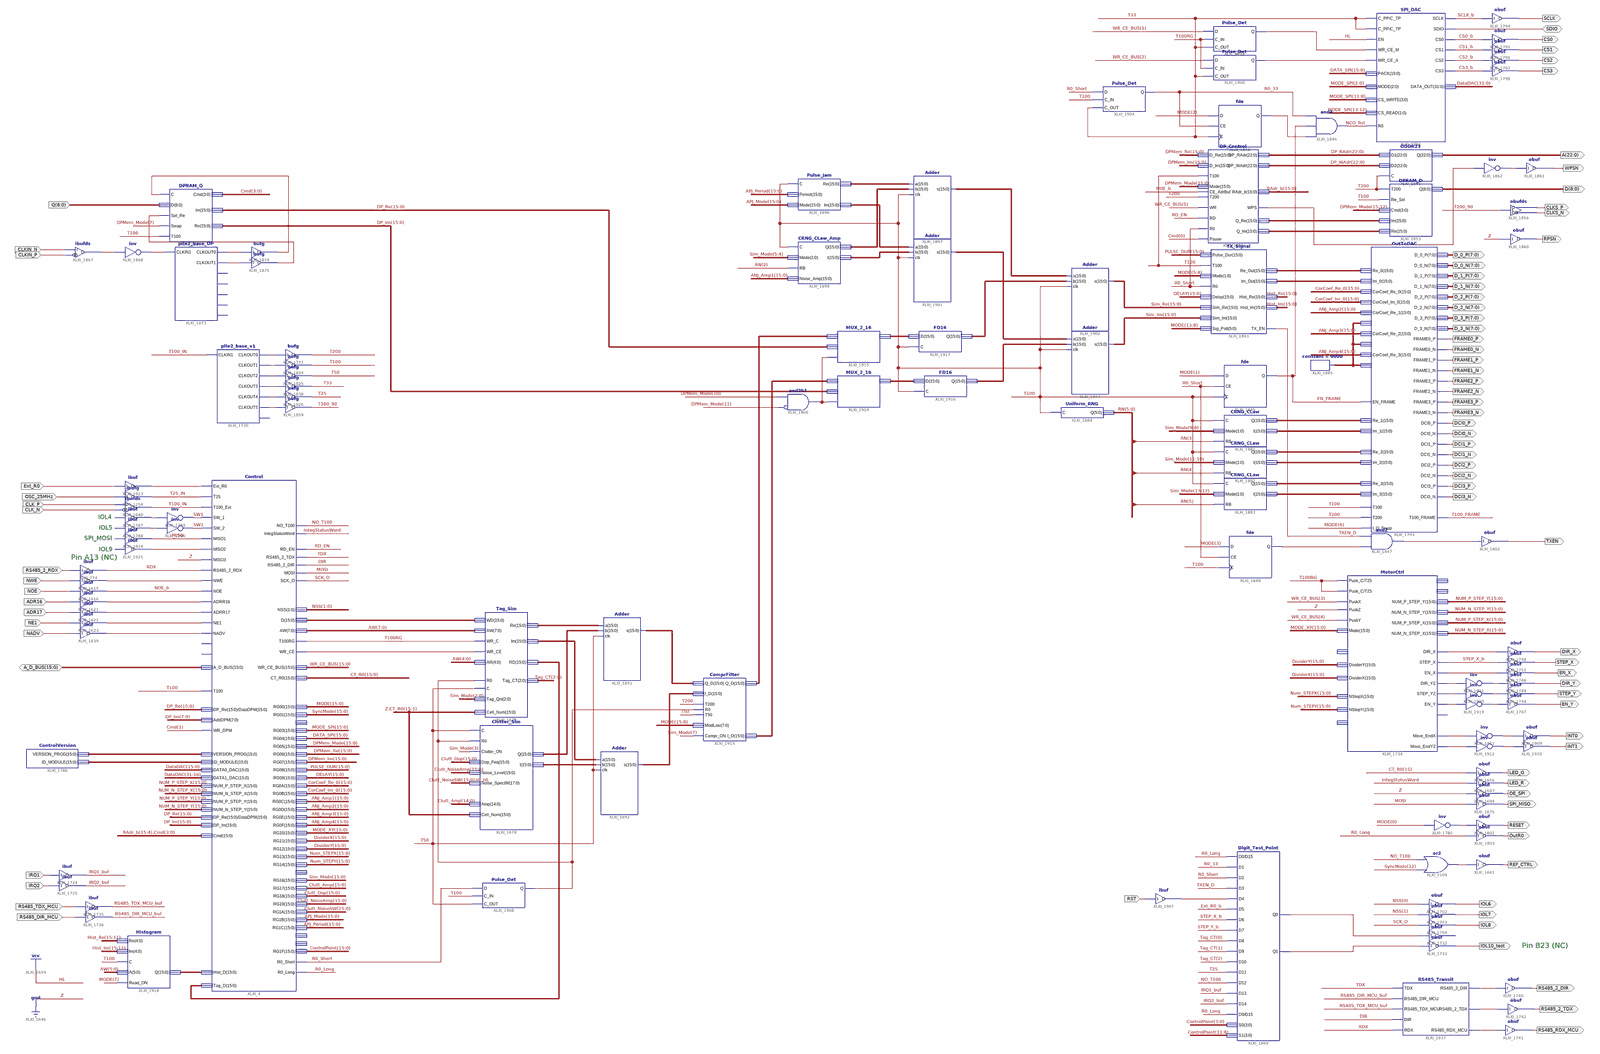
[diagram p0: schematic sheet 1, whole]
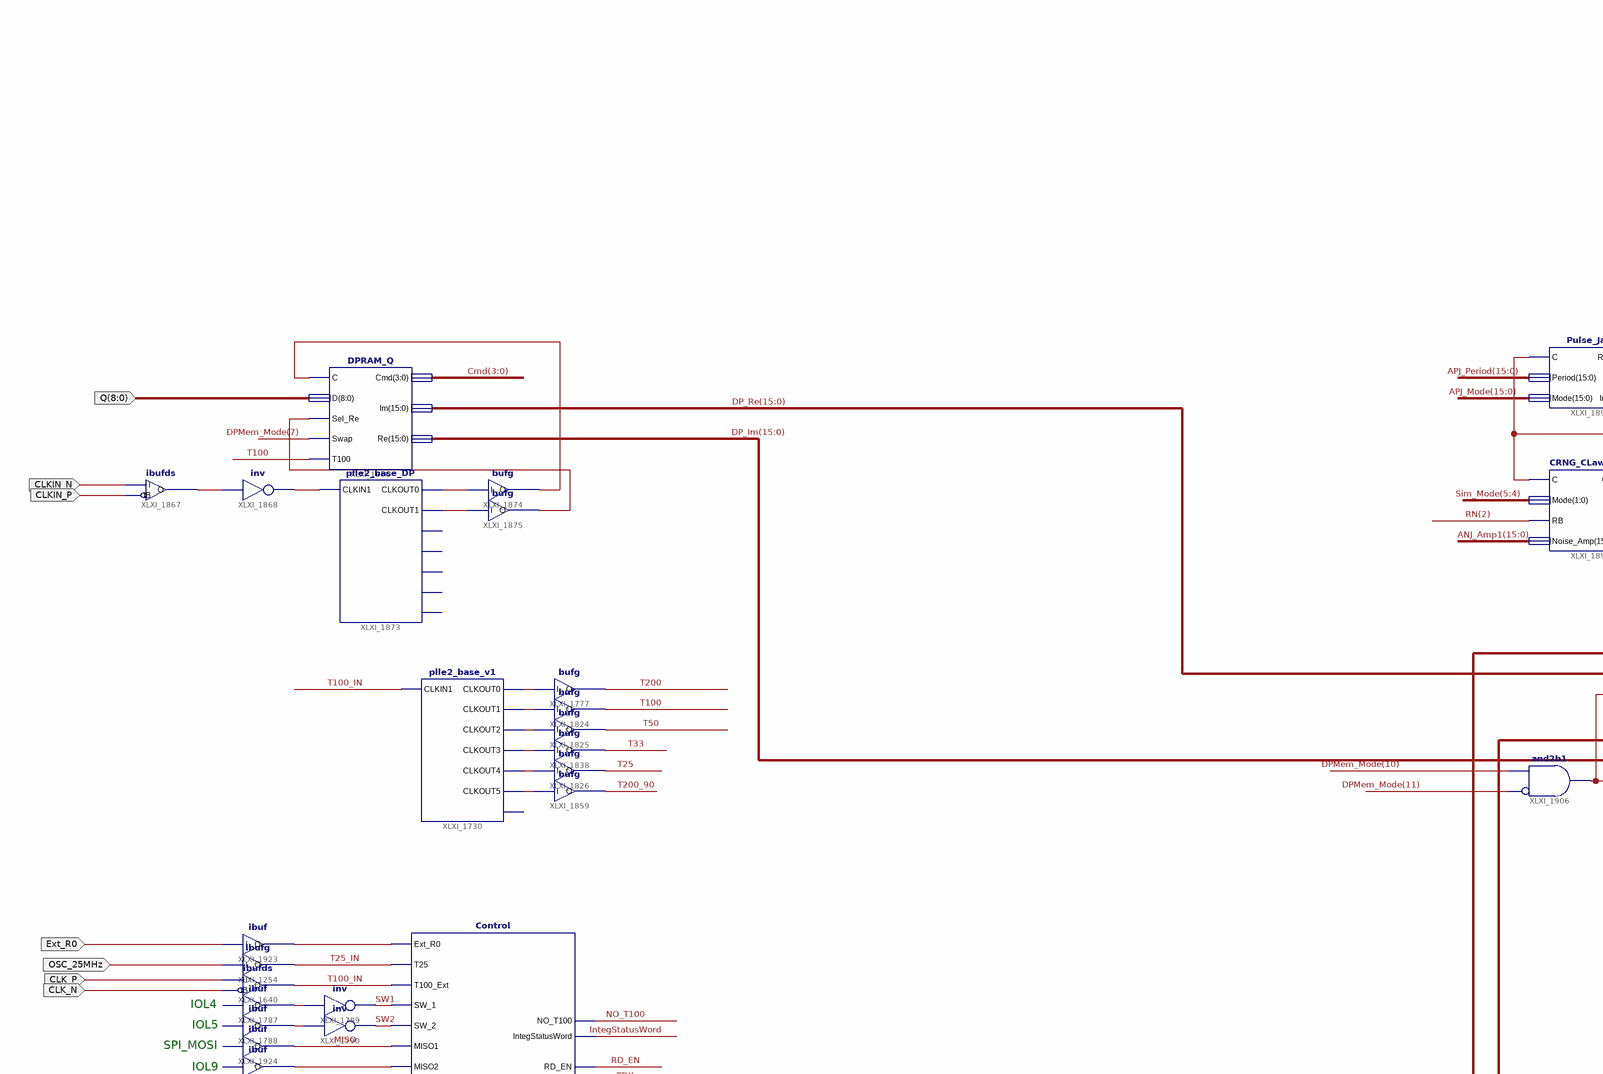
[diagram p1: schematic sheet 1, upper left part]
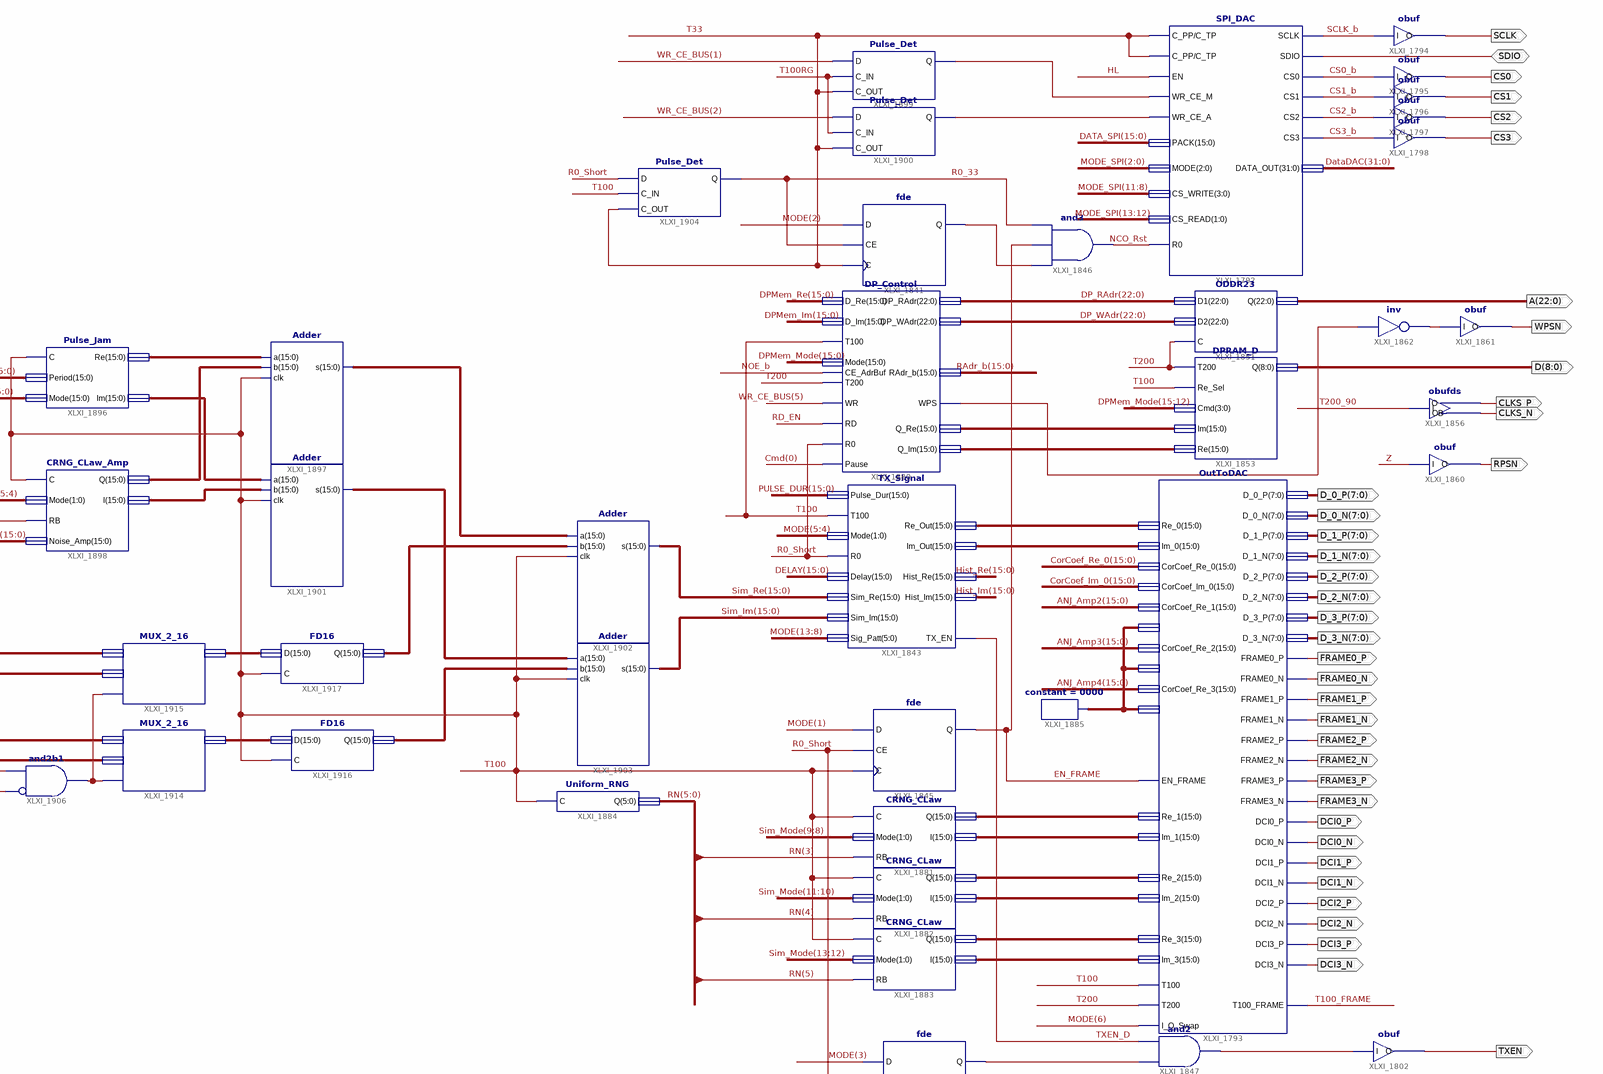
[diagram p2: schematic sheet 1, upper right part]
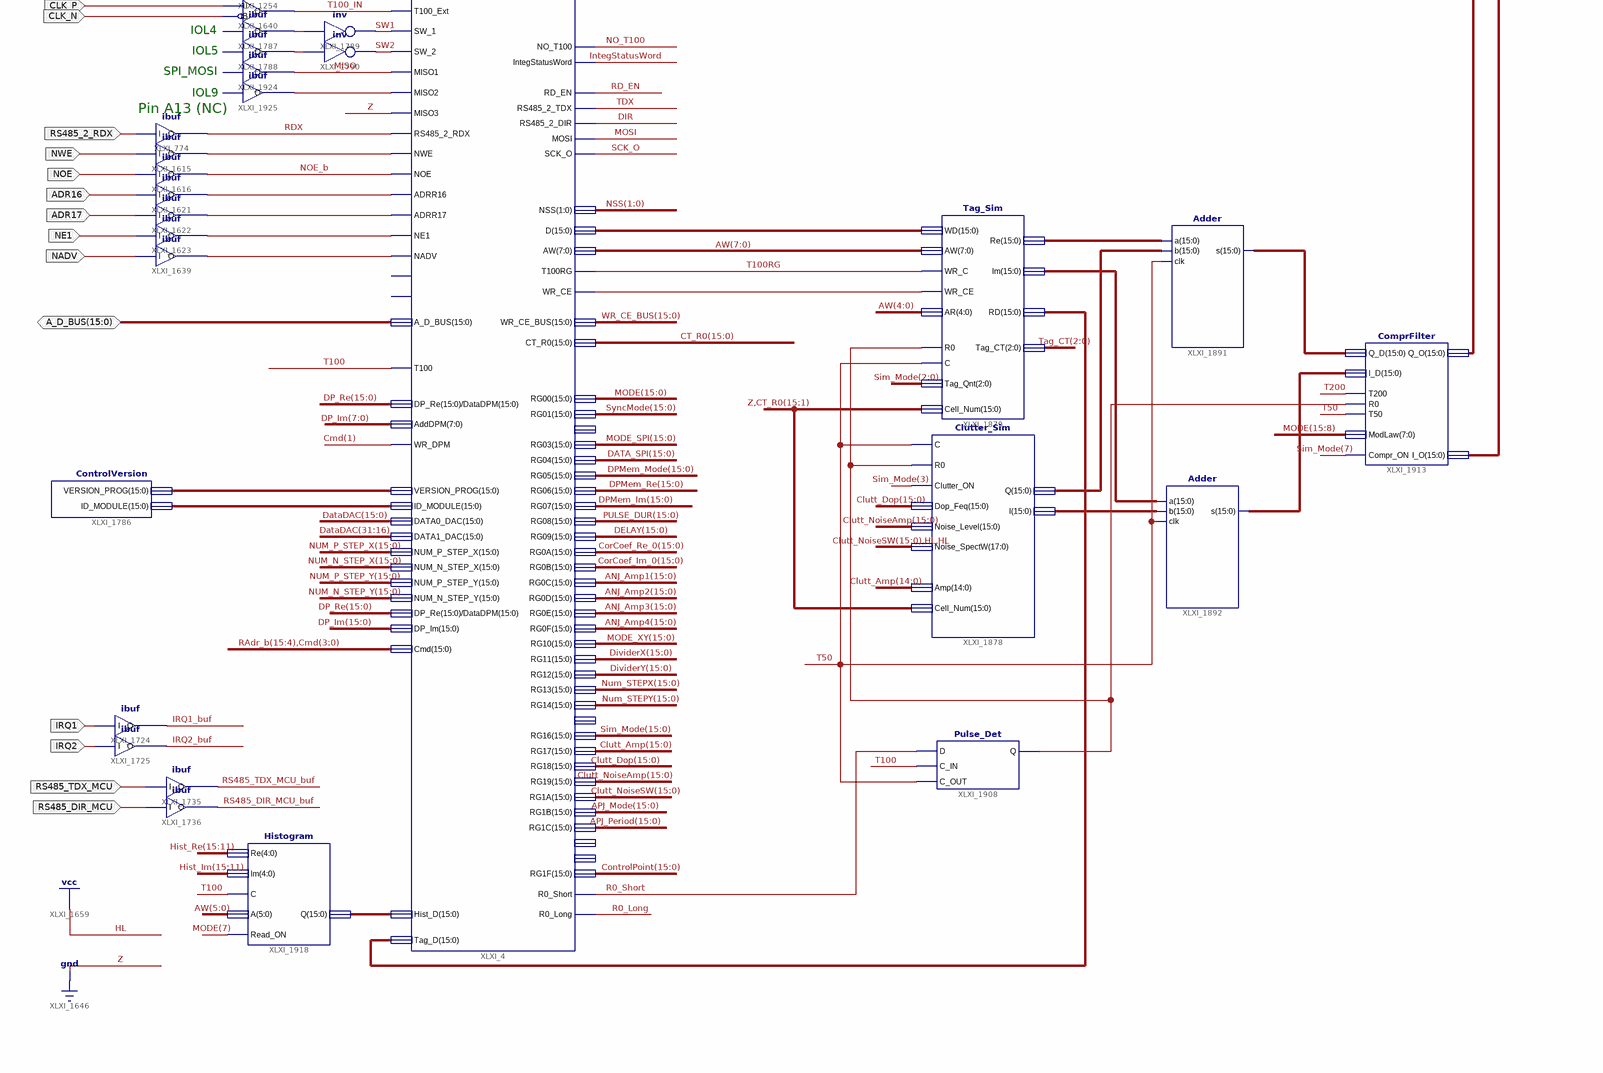
[diagram p3: schematic sheet 1, lower left part]
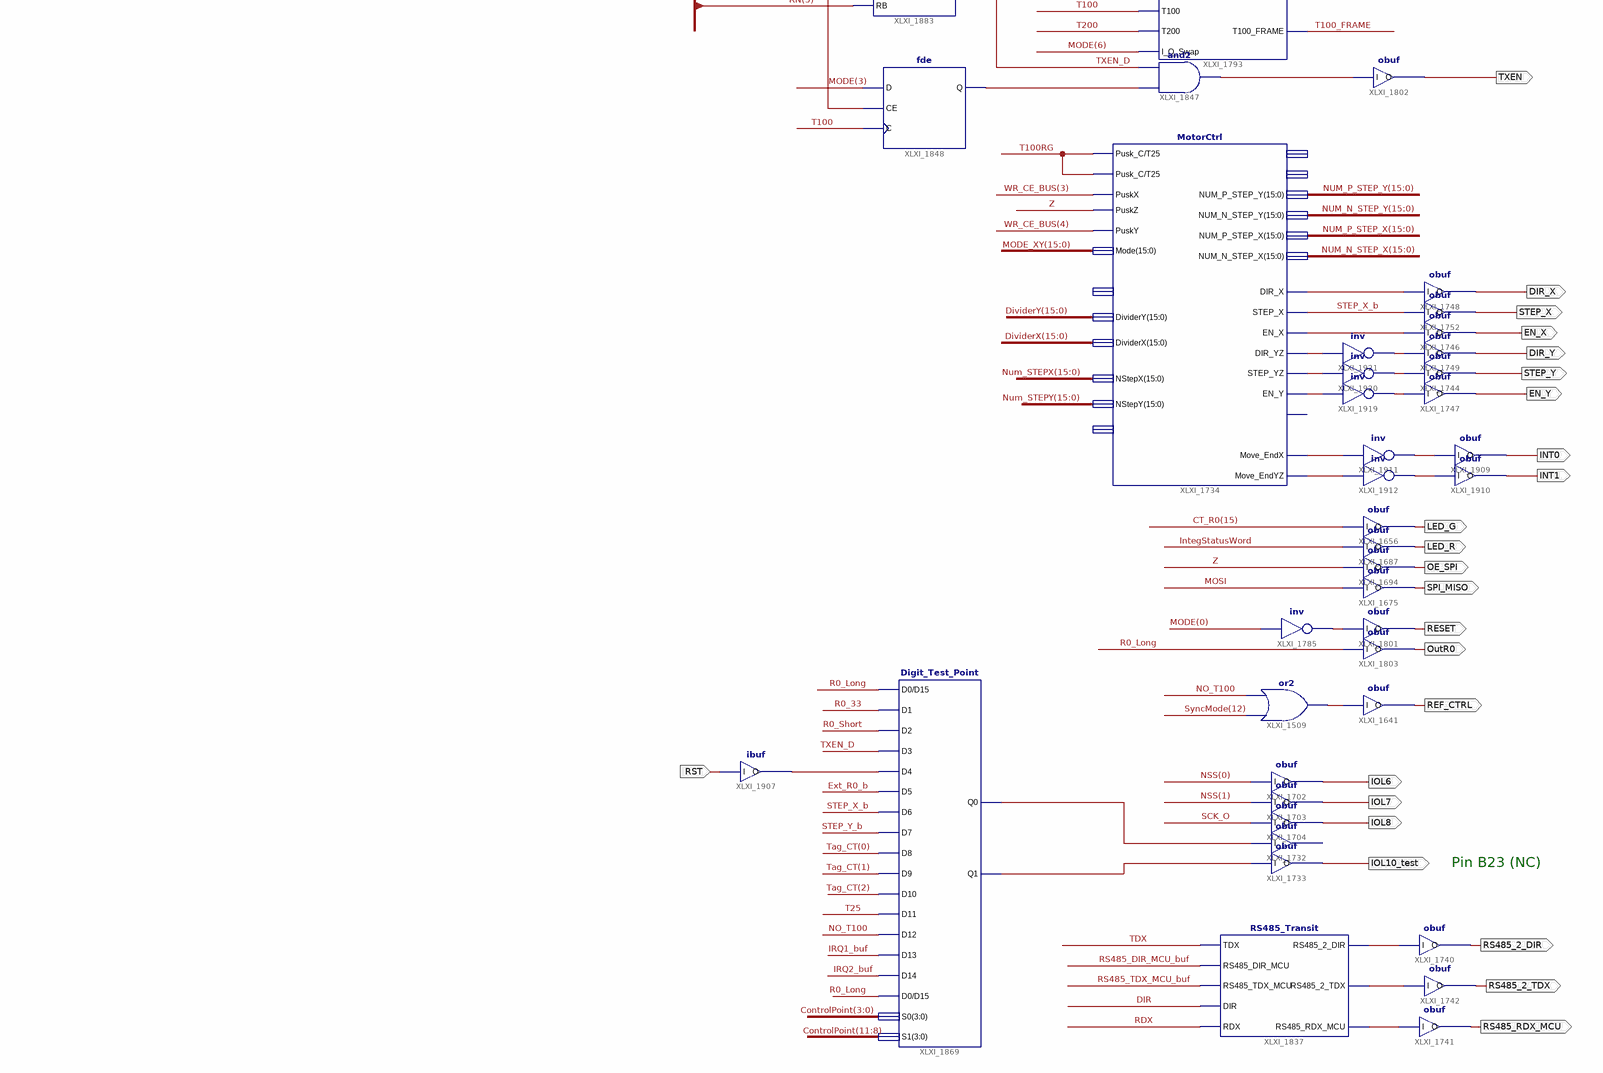
[diagram p4: schematic sheet 1, lower right part]
// Xilinx ISE schematic AST_TSM3.sch (kintex7) as structural Verilog: 116 symbols, 79 ports
module AST_TSM3 (
  input  RS485_2_RDX,
  input  OSC_25MHz,
  input  NWE,
  input  NOE,
  input  NE1,
  input  ADR16,
  input  ADR17,
  input  NADV,
  input  CLK_P,
  input  CLK_N,
  input  Ext_R0,
  input  RS485_DIR_MCU,
  input  RS485_TDX_MCU,
  input  IRQ1,
  input  IRQ2,
  input  [8:0] Q,
  input  CLKIN_N,
  input  CLKIN_P,
  input  RST,
  inout  SDIO,
  inout  [15:0] A_D_BUS,
  output REF_CTRL,
  output RS485_RDX_MCU,
  output LED_G,
  output CS0,
  output SCLK,
  output DIR_X,
  output STEP_X,
  output EN_X,
  output SPI_MISO,
  output OE_SPI,
  output IOL6,
  output IOL7,
  output IOL8,
  output IOL10_test,
  output RS485_2_DIR,
  output RS485_2_TDX,
  output STEP_Y,
  output EN_Y,
  output DIR_Y,
  output RESET,
  output TXEN,
  output LED_R,
  output CS1,
  output CS2,
  output CS3,
  output DCI0_P,
  output DCI0_N,
  output DCI1_P,
  output DCI2_P,
  output DCI1_N,
  output DCI2_N,
  output DCI3_P,
  output DCI3_N,
  output [7:0] D_0_P,
  output [7:0] D_0_N,
  output [7:0] D_1_N,
  output [7:0] D_2_P,
  output [7:0] D_2_N,
  output [7:0] D_3_P,
  output [7:0] D_3_N,
  output FRAME0_P,
  output FRAME0_N,
  output FRAME1_P,
  output FRAME1_N,
  output FRAME2_P,
  output FRAME2_N,
  output FRAME3_P,
  output FRAME3_N,
  output [7:0] D_1_P,
  output OutR0,
  output [8:0] D,
  output [22:0] A,
  output CLKS_P,
  output CLKS_N,
  output RPSN,
  output WPSN,
  output INT0,
  output INT1
);

  wire CS0_b, CS1_b, CS2_b, CS3_b, DIR, EN_FRAME, Ext_R0_b, IntegStatusWord, IRQ1_buf, IRQ2_buf, MISO, MOSI,
       NCO_Rst, NO_T100, NOE_b, R0_33, R0_Long, R0_Short, RD_EN, RDX, RS485_DIR_MCU_buf, RS485_TDX_MCU_buf,
       SCK_O, SCLK_b, STEP_X_b, STEP_Y_b, SW1, SW2, T25, T25_IN, T33, T50, T100, T100_FRAME, T100_IN, T100RG,
       T200, T200_90, TDX, TXEN_D, XLXN_332, XLXN_333, XLXN_334, XLXN_3976, XLXN_4316, XLXN_4327, XLXN_4366,
       XLXN_4384, XLXN_4385, XLXN_4482, XLXN_4495, XLXN_4497, XLXN_4498, XLXN_4499, XLXN_4500, XLXN_4619,
       XLXN_4623, XLXN_4624, XLXN_4631, XLXN_4632, XLXN_4658, XLXN_4663, XLXN_4665, XLXN_4686, XLXN_4694,
       XLXN_4702, XLXN_4704, XLXN_4705, XLXN_4744, XLXN_4745, XLXN_4746, XLXN_4748, XLXN_4750, XLXN_4764,
       XLXN_4822, XLXN_4849, XLXN_4851, XLXN_4858, XLXN_4859, XLXN_4868, XLXN_4869, XLXN_4870, XLXN_4871,
       XLXN_4872, XLXN_4883, XLXN_4884, XLXN_4885, XLXN_4886, XLXN_4887, XLXN_4888, XLXN_4889;
  wire [1:0] NSS;
  wire [2:0] Tag_CT;
  wire [3:0] Cmd;
  wire [5:0] RN;
  wire [7:0] AW;
  wire [15:0] ANJ_Amp1, ANJ_Amp2, ANJ_Amp3, ANJ_Amp4, APJ_Mode, APJ_Period, Clutt_Amp, Clutt_Dop,
       Clutt_NoiseAmp, Clutt_NoiseSW, ControlPoint, CorCoef_Im_0, CorCoef_Re_0, CT_R0, DATA_SPI, DELAY,
       DividerX, DividerY, DP_Im, DP_Re, DPMem_Im, DPMem_Mode, DPMem_Re, Hist_Im, Hist_Re, MODE, MODE_SPI,
       MODE_XY, NUM_N_STEP_X, NUM_N_STEP_Y, NUM_P_STEP_X, NUM_P_STEP_Y, Num_STEPX, Num_STEPY, PULSE_DUR,
       RAdr_b, Sim_Im, Sim_Mode, Sim_Re, SyncMode, WR_CE_BUS, XLXN_4509, XLXN_4510, XLXN_4641, XLXN_4642,
       XLXN_4676, XLXN_4677, XLXN_4783, XLXN_4784, XLXN_4785, XLXN_4786, XLXN_4787, XLXN_4788, XLXN_4799,
       XLXN_4800, XLXN_4802, XLXN_4803, XLXN_4804, XLXN_4805, XLXN_4806, XLXN_4807, XLXN_4823, XLXN_4824,
       XLXN_4825, XLXN_4826, XLXN_4829, XLXN_4830, XLXN_4831, XLXN_4832, XLXN_4844, XLXN_4875, XLXN_4876,
       XLXN_4878, XLXN_4881, XLXN_4882;
  wire [22:0] DP_RAdr, DP_WAdr;
  wire [31:0] DataDAC;

  Control XLXI_4 (
    .RS485_2_RDX(RDX), .T100_Ext(T100_IN), .Ext_R0(XLXN_3976), .DATA0_DAC(DataDAC[15:0]),
    .DATA1_DAC(DataDAC[31:16]), .MISO1(MISO), .MISO2(XLXN_4889), .MISO3(1'b0), .NUM_P_STEP_X(NUM_P_STEP_X),
    .NUM_N_STEP_X(NUM_N_STEP_X), .NUM_P_STEP_Y(NUM_P_STEP_Y), .NUM_N_STEP_Y(NUM_N_STEP_Y), .SW_1(SW1),
    .SW_2(SW2), .T25(T25_IN), .NWE(XLXN_4495), .NOE(NOE_b), .NE1(XLXN_4499), .ADRR17(XLXN_4498),
    .ADRR16(XLXN_4497), .NADV(XLXN_4500), .VERSION_PROG(XLXN_4509), .ID_MODULE(XLXN_4510), .T100(T100),
    .DP_Re(DP_Re), .DP_Im(DP_Im), .Cmd({RAdr_b[15:4], Cmd}), .DataDPM(DP_Re), .AddDPM(DP_Im[7:0]),
    .WR_DPM(Cmd[1]), .A_D_BUS(A_D_BUS), .RS485_2_DIR(DIR), .RS485_2_TDX(TDX), .WR_CE_BUS(WR_CE_BUS), .AW(AW),
    .WR_CE(XLXN_4822), .RG00(MODE), .RG01(SyncMode), .RG03(MODE_SPI), .RG04(DATA_SPI), .RG05(DPMem_Mode),
    .RG06(DPMem_Re), .RG07(DPMem_Im), .RG08(PULSE_DUR), .RG09(DELAY), .RG0A(CorCoef_Re_0),
    .RG0B(CorCoef_Im_0), .RG0C(ANJ_Amp1), .RG0D(ANJ_Amp2), .RG0E(ANJ_Amp3), .RG0F(ANJ_Amp4), .RG10(MODE_XY),
    .RG11(DividerX), .RG12(DividerY), .RG13(Num_STEPX), .RG14(Num_STEPY), .RG16(Sim_Mode), .RG17(Clutt_Amp),
    .RG18(Clutt_Dop), .RG19(Clutt_NoiseAmp), .RG1A(Clutt_NoiseSW), .RG1B(APJ_Mode), .RG1C(APJ_Period),
    .RG1F(ControlPoint), .SCK_O(SCK_O), .MOSI(MOSI), .NSS(NSS), .R0_Short(R0_Short), .CT_R0(CT_R0),
    .NO_T100(NO_T100), .D(XLXN_4800), .IntegStatusWord(IntegStatusWord), .R0_Long(R0_Long), .T100RG(T100RG),
    .RD_EN(RD_EN), .Tag_D(XLXN_4844), .Hist_D(XLXN_4882));  // open: VP, VN, RG02, RG15, RG1D, RG1E
  ibufg XLXI_1254 (.I(OSC_25MHz), .O(T25_IN));
  ibuf XLXI_1639 (.I(NADV), .O(XLXN_4500));
  ibuf XLXI_1621 (.I(ADR16), .O(XLXN_4497));
  ibuf XLXI_1622 (.I(ADR17), .O(XLXN_4498));
  ibuf XLXI_1623 (.I(NE1), .O(XLXN_4499));
  ibuf XLXI_774 (.I(RS485_2_RDX), .O(RDX));
  ibuf XLXI_1615 (.I(NWE), .O(XLXN_4495));
  ibuf XLXI_1616 (.I(NOE), .O(NOE_b));
  ibufds #(.DIFF_TERM("TRUE")) XLXI_1640 (.I(CLK_P), .IB(CLK_N), .O(T100_IN));
  obuf XLXI_1675 (.I(MOSI), .O(SPI_MISO));
  obuf XLXI_1694 (.I(1'b0), .O(OE_SPI));
  obuf XLXI_1702 (.I(NSS[0]), .O(IOL6));
  obuf XLXI_1703 (.I(NSS[1]), .O(IOL7));
  obuf XLXI_1704 (.I(SCK_O), .O(IOL8));
  ibuf XLXI_1724 (.I(IRQ1), .O(IRQ1_buf));
  ibuf XLXI_1725 (.I(IRQ2), .O(IRQ2_buf));
  obuf XLXI_1732 (.I(XLXN_4704));  // open: O
  obuf XLXI_1733 (.I(XLXN_4705), .O(IOL10_test));
  MotorCtrl XLXI_1734 (
    .NStepX(Num_STEPX), .Pusk_C(T100RG), .PuskX(WR_CE_BUS[3]), .PuskZ(1'b0), .Mode(MODE_XY), .T25(T100RG),
    .DividerY(DividerY), .DividerX(DividerX), .NStepY(Num_STEPY), .PuskY(WR_CE_BUS[4]), .STEP_X(STEP_X_b),
    .STEP_YZ(XLXN_4885), .EN_X(XLXN_4858), .NUM_P_STEP_X(NUM_P_STEP_X), .NUM_N_STEP_X(NUM_N_STEP_X),
    .NUM_N_STEP_Y(NUM_N_STEP_Y), .EN_Y(XLXN_4883), .DIR_X(XLXN_4859), .DIR_YZ(XLXN_4886),
    .NUM_P_STEP_Y(NUM_P_STEP_Y), .Move_EndX(XLXN_4871), .Move_EndYZ(XLXN_4870));  // open: NStepZ, DividerZ, NUM_N_STEP_Z, EN_Z, NUM_P_STEP_Z
  ibuf XLXI_1735 (.I(RS485_TDX_MCU), .O(RS485_TDX_MCU_buf));
  ibuf XLXI_1736 (.I(RS485_DIR_MCU), .O(RS485_DIR_MCU_buf));
  obuf XLXI_1740 (.I(XLXN_4316), .O(RS485_2_DIR));
  obuf XLXI_1741 (.I(XLXN_4327), .O(RS485_RDX_MCU));
  obuf XLXI_1742 (.I(XLXN_4619), .O(RS485_2_TDX));
  obuf XLXI_1744 (.I(XLXN_4888), .O(STEP_Y));
  obuf XLXI_1746 (.I(XLXN_4858), .O(EN_X));
  obuf XLXI_1747 (.I(XLXN_4884), .O(EN_Y));
  obuf XLXI_1748 (.I(XLXN_4859), .O(DIR_X));
  obuf XLXI_1749 (.I(XLXN_4887), .O(DIR_Y));
  obuf XLXI_1752 (.I(STEP_X_b), .O(STEP_X));
  or XLXI_1509 (XLXN_4366, SyncMode[12], NO_T100);
  obuf XLXI_1641 (.I(XLXN_4366), .O(REF_CTRL));
  ibuf XLXI_1787 (.O(XLXN_4384));  // open: I
  ibuf XLXI_1788 (.O(XLXN_4385));  // open: I
  not XLXI_1789 (SW1, XLXN_4384);
  not XLXI_1790 (SW2, XLXN_4385);
  SPI_DAC XLXI_1792 (
    .C_PP(T33), .C_TP(T33), .EN(1'b1), .WR_CE_M(XLXN_4632), .WR_CE_A(XLXN_4631), .R0(NCO_Rst),
    .PACK(DATA_SPI), .CS_WRITE(MODE_SPI[11:8]), .CS_READ(MODE_SPI[13:12]), .MODE(MODE_SPI[2:0]), .SDIO(SDIO),
    .CS0(CS0_b), .CS1(CS1_b), .CS2(CS2_b), .CS3(CS3_b), .SCLK(SCLK_b), .DATA_OUT(DataDAC));
  OutToDAC XLXI_1793 (
    .T100(T100), .T200(T200), .EN_FRAME(EN_FRAME), .I_Q_Swap(MODE[6]), .CorCoef_Re_0(CorCoef_Re_0),
    .CorCoef_Im_0(CorCoef_Im_0), .CorCoef_Re_1(ANJ_Amp2), .CorCoef_Im_1(XLXN_4799), .CorCoef_Re_2(ANJ_Amp3),
    .CorCoef_Im_2(XLXN_4799), .CorCoef_Re_3(ANJ_Amp4), .CorCoef_Im_3(XLXN_4799), .T100_FRAME(T100_FRAME),
    .DCI0_P(DCI0_P), .DCI0_N(DCI0_N), .DCI1_P(DCI1_P), .DCI2_P(DCI2_P), .DCI1_N(DCI1_N), .DCI2_N(DCI2_N),
    .DCI3_P(DCI3_P), .DCI3_N(DCI3_N), .D_0_P(D_0_P), .D_0_N(D_0_N), .D_1_P(D_1_P), .D_1_N(D_1_N),
    .D_2_P(D_2_P), .D_2_N(D_2_N), .D_3_P(D_3_P), .D_3_N(D_3_N), .FRAME0_P(FRAME0_P), .FRAME0_N(FRAME0_N),
    .FRAME1_P(FRAME1_P), .FRAME1_N(FRAME1_N), .FRAME2_P(FRAME2_P), .FRAME2_N(FRAME2_N), .FRAME3_P(FRAME3_P),
    .FRAME3_N(FRAME3_N), .Re_3(XLXN_4783), .Im_3(XLXN_4784), .Im_1(XLXN_4788), .Im_2(XLXN_4785),
    .Im_0(XLXN_4642), .Re_0(XLXN_4641), .Re_2(XLXN_4786), .Re_1(XLXN_4787));
  obuf XLXI_1794 (.I(SCLK_b), .O(SCLK));
  obuf XLXI_1795 (.I(CS0_b), .O(CS0));
  obuf XLXI_1796 (.I(CS1_b), .O(CS1));
  obuf XLXI_1797 (.I(CS2_b), .O(CS2));
  obuf XLXI_1798 (.I(CS3_b), .O(CS3));
  ControlVersion XLXI_1786 (.VERSION_PROG(XLXN_4509), .ID_MODULE(XLXN_4510));
  plle2_base_v1 XLXI_1730 (
    .CLKIN1(T100_IN), .CLKOUT0(XLXN_332), .CLKOUT1(XLXN_333), .CLKOUT2(XLXN_334), .CLKOUT3(XLXN_4623),
    .CLKOUT4(XLXN_4624), .CLKOUT5(XLXN_4686));  // open: LOCKED
  bufg XLXI_1777 (.I(XLXN_332), .O(T200));
  bufg XLXI_1824 (.I(XLXN_333), .O(T100));
  bufg XLXI_1825 (.I(XLXN_334), .O(T50));
  bufg XLXI_1826 (.I(XLXN_4624), .O(T25));
  obuf XLXI_1803 (.I(R0_Long), .O(OutR0));
  obuf XLXI_1656 (.I(CT_R0[15]), .O(LED_G));
  obuf XLXI_1687 (.I(IntegStatusWord), .O(LED_R));
  obuf XLXI_1801 (.I(XLXN_4482), .O(RESET));
  obuf XLXI_1802 (.I(XLXN_4663), .O(TXEN));
  not XLXI_1785 (XLXN_4482, MODE[0]);
  RS485_Transit XLXI_1837 (
    .TDX(TDX), .RS485_DIR_MCU(RS485_DIR_MCU_buf), .RS485_TDX_MCU(RS485_TDX_MCU_buf), .DIR(DIR), .RDX(RDX),
    .RS485_2_DIR(XLXN_4316), .RS485_2_TDX(XLXN_4619), .RS485_RDX_MCU(XLXN_4327));
  bufg XLXI_1838 (.I(XLXN_4623), .O(T33));
  fde XLXI_1841 (.C(T33), .CE(R0_33), .D(MODE[2]), .Q(XLXN_4658));
  TX_Signal XLXI_1843 (
    .Pulse_Dur(PULSE_DUR), .T100(T100), .Mode(MODE[5:4]), .R0(R0_Short), .Delay(DELAY), .Sim_Re(Sim_Re),
    .Sim_Im(Sim_Im), .Sig_Patt(MODE[13:8]), .Re_Out(XLXN_4641), .TX_EN(TXEN_D), .Im_Out(XLXN_4642),
    .Hist_Re(Hist_Re), .Hist_Im(Hist_Im));
  fde XLXI_1845 (.C(T100), .CE(R0_Short), .D(MODE[1]), .Q(EN_FRAME));
  and XLXI_1846 (NCO_Rst, XLXN_4658, EN_FRAME, R0_33);
  and XLXI_1847 (XLXN_4663, XLXN_4665, TXEN_D);
  fde XLXI_1848 (.C(T100), .CE(R0_Short), .D(MODE[3]), .Q(XLXN_4665));
  ODDR23 XLXI_1851 (.D1(DP_RAdr), .D2(DP_WAdr), .C(T200), .Q(A));
  DPRAM_D XLXI_1853 (.T200(T200), .Cmd(DPMem_Mode[15:12]), .Im(XLXN_4676), .Re(XLXN_4677), .Q(D), .Re_Sel(T100));
  obufds XLXI_1856 (.I(T200_90), .O(CLKS_P), .OB(CLKS_N));
  bufg XLXI_1859 (.I(XLXN_4686), .O(T200_90));
  obuf XLXI_1860 (.I(1'b0), .O(RPSN));
  obuf XLXI_1861 (.I(XLXN_4694), .O(WPSN));
  not XLXI_1862 (XLXN_4694, XLXN_4764);
  DPRAM_Q XLXI_1866 (
    .C(XLXN_4746), .D(Q), .Sel_Re(XLXN_4750), .Swap(DPMem_Mode[7]), .Cmd(Cmd), .Im(DP_Re), .Re(DP_Im),
    .T100(T100));
  ibufds XLXI_1867 (.I(CLKIN_N), .IB(CLKIN_P), .O(XLXN_4702));
  not XLXI_1868 (XLXN_4744, XLXN_4702);
  Digit_Test_Point XLXI_1869 (
    .D0(R0_Long), .D1(R0_33), .D2(R0_Short), .D3(TXEN_D), .D4(XLXN_4851), .D5(Ext_R0_b), .D6(STEP_X_b),
    .D7(STEP_Y_b), .S0(ControlPoint[3:0]), .S1(ControlPoint[11:8]), .Q0(XLXN_4704), .Q1(XLXN_4705),
    .D9(Tag_CT[1]), .D10(Tag_CT[2]), .D11(T25), .D12(NO_T100), .D13(IRQ1_buf), .D14(IRQ2_buf), .D15(R0_Long),
    .D8(Tag_CT[0]));
  plle2_base_DP XLXI_1873 (
    .CLKIN1(XLXN_4744), .CLKOUT0(XLXN_4745), .CLKOUT1(XLXN_4748));  // open: CLKOUT2, CLKOUT3, CLKOUT4, CLKOUT5, LOCKED
  bufg XLXI_1874 (.I(XLXN_4745), .O(XLXN_4746));
  bufg XLXI_1875 (.I(XLXN_4748), .O(XLXN_4750));
  Clutter_Sim XLXI_1878 (
    .R0(XLXN_4872), .Dop_Feq(Clutt_Dop), .Noise_Level(Clutt_NoiseAmp), .Amp(Clutt_Amp[14:0]),
    .Noise_SpectW({Clutt_NoiseSW, 2'b11}), .C(T50), .Clutter_ON(Sim_Mode[3]), .Cell_Num({1'b0, CT_R0[15:1]}),
    .Q(XLXN_4803), .I(XLXN_4804));
  Tag_Sim XLXI_1879 (
    .Cell_Num({1'b0, CT_R0[15:1]}), .WD(XLXN_4800), .AW(AW), .Im(XLXN_4805), .Re(XLXN_4802), .AR(AW[4:0]),
    .RD(XLXN_4844), .Tag_Qnt(Sim_Mode[2:0]), .C(T50), .R0(XLXN_4872), .Tag_CT(Tag_CT), .WR_CE(XLXN_4822),
    .WR_C(T100RG));
  DP_Control XLXI_1880 (
    .D_Re(DPMem_Re), .D_Im(DPMem_Im), .T100(T100), .Mode(DPMem_Mode), .T200(T200), .WR(WR_CE_BUS[5]),
    .RD(RD_EN), .R0(R0_Short), .Pause(Cmd[0]), .DP_WAdr(DP_WAdr), .DP_RAdr(DP_RAdr), .Q_Re(XLXN_4676),
    .Q_Im(XLXN_4677), .WPS(XLXN_4764), .CE_AdrBuf(NOE_b), .RAdr_b(RAdr_b));
  CRNG_CLaw XLXI_1881 (.C(T100), .Mode(Sim_Mode[9:8]), .Q(XLXN_4787), .I(XLXN_4788), .RB(RN[3]));
  CRNG_CLaw XLXI_1882 (.C(T100), .Mode(Sim_Mode[11:10]), .Q(XLXN_4786), .I(XLXN_4785), .RB(RN[4]));
  CRNG_CLaw XLXI_1883 (.C(T100), .Mode(Sim_Mode[13:12]), .Q(XLXN_4783), .I(XLXN_4784), .RB(RN[5]));
  Uniform_RNG XLXI_1884 (.Q(RN), .C(T100));
  constant #(.CValue("0000")) XLXI_1885 (.O(XLXN_4799));
  Adder XLXI_1891 (.a(XLXN_4802), .b(XLXN_4803), .clk(T50), .s(XLXN_4806));
  Adder XLXI_1892 (.a(XLXN_4805), .b(XLXN_4804), .clk(T50), .s(XLXN_4807));
  Pulse_Jam XLXI_1896 (.C(T100), .Period(APJ_Period), .Mode(APJ_Mode), .Re(XLXN_4825), .Im(XLXN_4823));
  Adder XLXI_1897 (.a(XLXN_4825), .b(XLXN_4826), .clk(T100), .s(XLXN_4829));
  CRNG_CLaw_Amp XLXI_1898 (
    .C(T100), .Mode(Sim_Mode[5:4]), .RB(RN[2]), .Noise_Amp(ANJ_Amp1), .Q(XLXN_4826), .I(XLXN_4824));
  Pulse_Det XLXI_1899 (.Q(XLXN_4632), .C_OUT(T33), .D(WR_CE_BUS[1]), .C_IN(T100RG));
  Pulse_Det XLXI_1900 (.Q(XLXN_4631), .C_OUT(T33), .D(WR_CE_BUS[2]), .C_IN(T100RG));
  Adder XLXI_1901 (.a(XLXN_4823), .b(XLXN_4824), .clk(T100), .s(XLXN_4831));
  Adder XLXI_1902 (.a(XLXN_4829), .b(XLXN_4878), .clk(T100), .s(Sim_Re));
  Adder XLXI_1903 (.a(XLXN_4831), .b(XLXN_4832), .clk(T100), .s(Sim_Im));
  Pulse_Det XLXI_1904 (.Q(R0_33), .C_OUT(T33), .D(R0_Short), .C_IN(T100));
  and XLXI_1906 (XLXN_4849, ~DPMem_Mode[11], DPMem_Mode[10]);  // and2b1
  ibuf XLXI_1907 (.I(RST), .O(XLXN_4851));
  Pulse_Det XLXI_1908 (.Q(XLXN_4872), .C_OUT(T50), .D(R0_Short), .C_IN(T100));
  obuf XLXI_1909 (.I(XLXN_4868), .O(INT0));
  obuf XLXI_1910 (.I(XLXN_4869), .O(INT1));
  not XLXI_1911 (XLXN_4868, XLXN_4871);
  not XLXI_1912 (XLXN_4869, XLXN_4870);
  ComprFilter XLXI_1913 (
    .Q_D(XLXN_4806), .I_D(XLXN_4807), .T200(T200), .T50(T50), .ModLaw(MODE[15:8]), .Compr_ON(Sim_Mode[7]),
    .R0(XLXN_4872), .Q_O(XLXN_4876), .I_O(XLXN_4875));
  MUX_2_16 XLXI_1914 ();  // open: DATA_0, DATA_1, Q, SEL
  MUX_2_16 XLXI_1915 ();  // open: DATA_0, DATA_1, Q, SEL
  FD16 XLXI_1916 (.D(XLXN_4881), .C(T100), .Q(XLXN_4832));
  FD16 XLXI_1917 (.D(XLXN_4830), .C(T100), .Q(XLXN_4878));
  Histogram XLXI_1918 (
    .Read_ON(MODE[7]), .Re(Hist_Re[15:11]), .Im(Hist_Im[15:11]), .A(AW[5:0]), .Q(XLXN_4882), .C(T100));
  not XLXI_1919 (XLXN_4884, XLXN_4883);
  not XLXI_1920 (XLXN_4888, XLXN_4885);
  not XLXI_1921 (XLXN_4887, XLXN_4886);
  ibuf XLXI_1923 (.I(Ext_R0), .O(XLXN_3976));
  ibuf XLXI_1924 (.O(MISO));  // open: I
  ibuf XLXI_1925 (.O(XLXN_4889));  // open: I

  // Notes on the sheet:
  //   IOL4
  //   IOL5
  //   SPI_MOSI
  //   IOL9
  //   Pin A13 (NC)
  //   Pin B23 (NC)
endmodule
